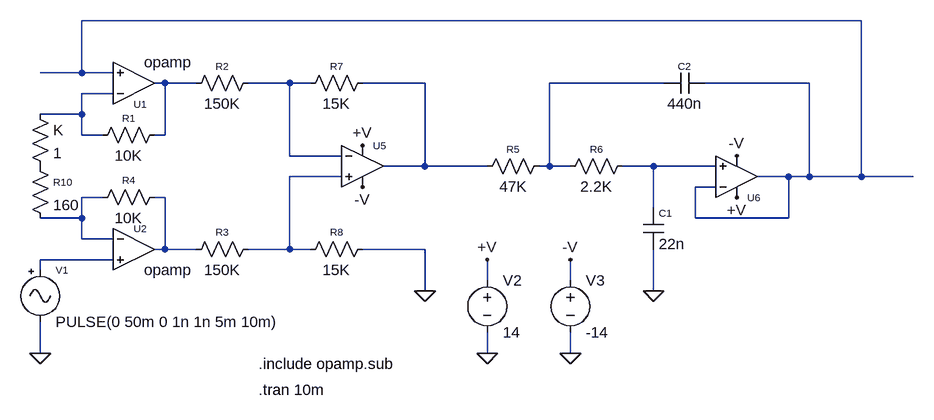
[diagram p0: schematic experiment.asc]
experiment.asc, the LTspice schematic file:
Version 4
SHEET 1 1060 896
WIRE 976 80 -224 80
WIRE -224 160 -224 80
WIRE -224 160 -288 160
WIRE -176 160 -224 160
WIRE -96 176 -112 176
WIRE -48 176 -96 176
WIRE 96 176 32 176
WIRE 128 176 96 176
WIRE 304 176 208 176
WIRE 672 176 496 176
WIRE 896 176 736 176
WIRE -176 192 -224 192
WIRE -224 224 -224 192
WIRE -224 224 -288 224
WIRE -224 256 -224 224
WIRE -192 256 -224 256
WIRE -96 256 -96 176
WIRE -96 256 -112 256
WIRE 96 288 96 176
WIRE 176 288 96 288
WIRE 304 304 304 176
WIRE 304 304 240 304
WIRE 400 304 304 304
WIRE 496 304 496 176
WIRE 496 304 480 304
WIRE 528 304 496 304
WIRE 656 304 608 304
WIRE 752 304 656 304
WIRE 176 320 96 320
WIRE 864 320 816 320
WIRE 896 320 896 176
WIRE 896 320 864 320
WIRE 976 320 976 80
WIRE 976 320 896 320
WIRE 1056 320 976 320
WIRE 752 336 720 336
WIRE -192 352 -224 352
WIRE -96 352 -112 352
WIRE 656 368 656 304
WIRE -224 384 -224 352
WIRE -224 384 -288 384
WIRE 720 384 720 336
WIRE 864 384 864 320
WIRE 864 384 720 384
WIRE -224 416 -224 384
WIRE -176 416 -224 416
WIRE -96 432 -96 352
WIRE -96 432 -112 432
WIRE -48 432 -96 432
WIRE 96 432 96 320
WIRE 96 432 32 432
WIRE 128 432 96 432
WIRE 304 432 208 432
WIRE -176 448 -288 448
WIRE -288 464 -288 448
WIRE 400 480 400 448
WIRE 528 480 528 448
WIRE 304 496 304 432
WIRE 656 496 656 432
WIRE -288 592 -288 544
WIRE 400 592 400 560
WIRE 528 592 528 560
FLAG 400 448 +V
FLAG 528 448 -V
FLAG 208 272 +V
FLAG 208 336 -V
FLAG 784 288 -V
FLAG 784 352 +V
FLAG 304 496 0
FLAG -288 592 0
FLAG 400 592 0
FLAG 528 592 0
FLAG 656 496 0
SYMBOL opamp -144 240 M180
WINDOW 0 0 32 Left 1
SYMATTR InstName U1
SYMBOL opamp -144 368 R0
WINDOW 0 0 32 Left 1
SYMATTR InstName U2
SYMBOL res -96 240 R90
WINDOW 0 0 56 VBottom 1
WINDOW 3 32 56 VTop 2
SYMATTR InstName R1
SYMATTR Value 10K
SYMBOL res 48 160 R90
WINDOW 0 0 56 VBottom 1
WINDOW 3 32 56 VTop 2
SYMATTR InstName R2
SYMATTR Value 150K
SYMBOL res 48 416 R90
WINDOW 0 0 56 VBottom 1
WINDOW 3 32 56 VTop 2
SYMATTR InstName R3
SYMATTR Value 150K
SYMBOL res -96 336 R90
WINDOW 0 0 56 VBottom 1
WINDOW 3 32 56 VTop 2
SYMATTR InstName R4
SYMATTR Value 10K
SYMBOL res 496 288 R90
WINDOW 0 0 56 VBottom 1
WINDOW 3 32 56 VTop 2
SYMATTR InstName R5
SYMATTR Value 47K
SYMBOL res 624 288 R90
WINDOW 0 0 56 VBottom 1
WINDOW 3 32 56 VTop 2
SYMATTR InstName R6
SYMATTR Value 2.2K
SYMBOL cap 640 368 R0
WINDOW 0 24 8 Left 1
SYMATTR InstName C1
SYMATTR Value 22n
SYMATTR SpiceLine Rser=16.5m Lser=200p mfg="Würth Elektronik" pn="885012205014 WCAP-CSGP 0402" type="X7R"
SYMBOL cap 736 160 R90
WINDOW 0 0 32 VBottom 1
WINDOW 3 32 32 VTop 2
SYMATTR InstName C2
SYMATTR Value 440n
SYMATTR SpiceLine Rser=35.9m
SYMBOL res 224 160 R90
WINDOW 0 0 56 VBottom 1
WINDOW 3 32 56 VTop 2
SYMATTR InstName R7
SYMATTR Value 15K
SYMBOL res 224 416 R90
WINDOW 0 0 56 VBottom 1
WINDOW 3 32 56 VTop 2
SYMATTR InstName R8
SYMATTR Value 15K
SYMBOL UniversalOpAmp 208 304 R0
WINDOW 0 16 -32 Left 1
SYMATTR InstName U5
SYMBOL UniversalOpAmp 784 320 M180
WINDOW 0 16 -32 Left 1
SYMATTR InstName U6
SYMBOL res -304 208 R0
SYMATTR InstName K
SYMATTR Value 1
SYMBOL res -304 288 R0
WINDOW 0 36 40 Left 1
SYMATTR InstName R10
SYMATTR Value 160
SYMBOL signal -288 448 R0
WINDOW 0 24 16 Left 1
SYMATTR InstName V1
SYMATTR Value PULSE(0 50m 0 1n 1n 5m 10m)
SYMATTR SpiceLine Rser=50
SYMBOL voltage 400 464 R0
SYMATTR InstName V2
SYMATTR Value 14
SYMBOL voltage 528 464 R0
SYMATTR InstName V3
SYMATTR Value -14
TEXT 48 608 Left 2 !.include opamp.sub
TEXT 48 648 Left 2 !.tran 10m

The netlist it stands for:
* experiment.asc
XU1 N006 N001 N002 opamp Aol=100K GBW=10Meg  ; pins invin noninvin out
XU2 N009 N011 N010 opamp Aol=100K GBW=10Meg  ; pins invin noninvin out
R1 N002 N006 10K
R2 N003 N002 150K
R3 N008 N010 150K
R4 N010 N009 10K
R5 N005 N004 47K
R6 N007 N005 2.2K
C1 N007 0 22n Rser=16.5m Lser=200p mfg="Würth Elektronik" pn="885012205014 WCAP-CSGP 0402" type="X7R"
C2 N001 N005 440n Rser=35.9m
R7 N004 N003 15K
R8 0 N008 15K
XU5 N008 N003 +V -V N004 level1 Avol=1Meg GBW=10Meg Vos=0 En=0 Enk=0 In=0 Ink=0 Rin=500Meg  ; pins In+ In- V+ V- OUT
XU6 N007 N001 +V -V N001 level1 Avol=1Meg GBW=10Meg Vos=0 En=0 Enk=0 In=0 Ink=0 Rin=500Meg  ; pins In+ In- V+ V- OUT
R§K N006 P001 1
R10 P001 N009 160
V1 N011 0 PULSE(0 50m 0 1n 1n 5m 10m) Rser=50
V2 +V 0 14
V3 -V 0 -14
.include opamp.sub
.tran 10m
.lib UniversalOpAmp1.lib
.backanno
.end